# Altium schematic sheet STLink_V3E_PWR.SchDoc
size 420 x 297 mm; SheetNumber: 3; SheetTotal: 3
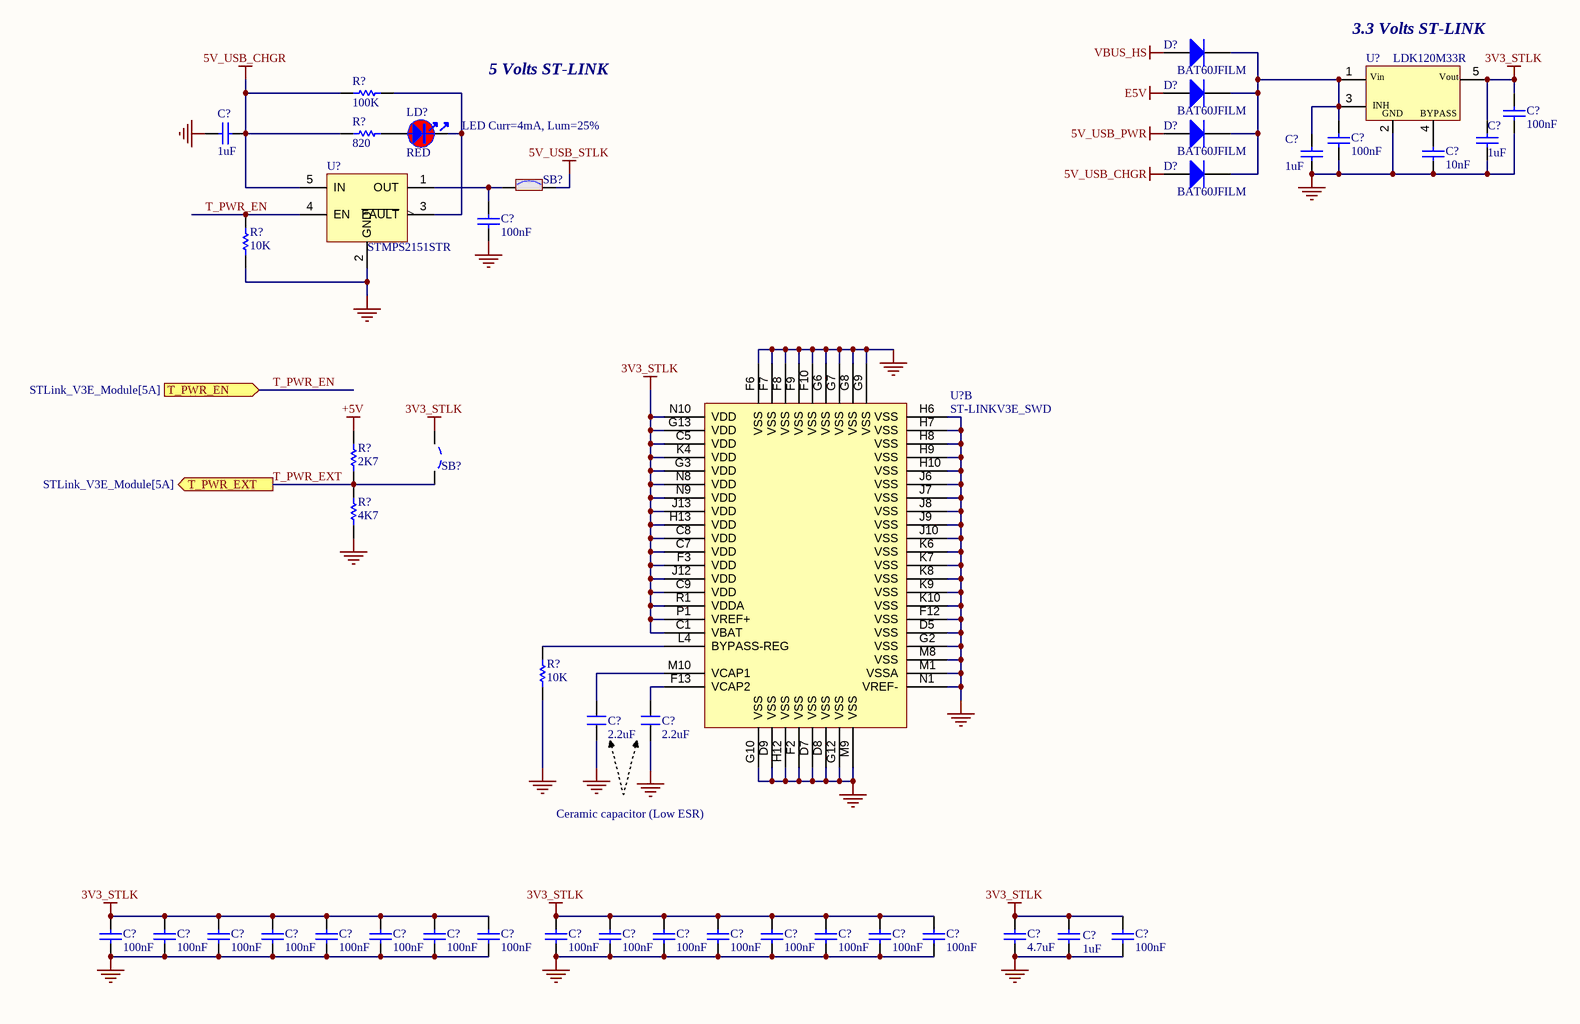
[diagram p0: STLink_V3E_PWR.SchDoc]

## Parts
(Parts that share a designator on the sheet are numbered #1, #2 ... from top to bottom, then left to right.)
C?#1  100nF  [0603C]
C?#2  1uF  [0603C]
C?#3  100nF  [0603C]
C?#4  1uF  [0603C]
C?#5  1uF  [0603C]
C?#6  10nF  [0603C]
C?#7  100nF  [0603C]
C?#8  2.2uF  [CN1.5]
C?#9  2.2uF  [CN1.5]
C?#10  100nF  [0402C]
C?#11  100nF  [0402C]
C?#12  100nF  [0402C]
C?#13  100nF  [0402C]
C?#14  100nF  [0402C]
C?#15  100nF  [0402C]
C?#16  100nF  [0402C]
C?#17  100nF  [0402C]
C?#18  100nF  [0402C]
C?#19  100nF  [0402C]
C?#20  100nF  [0402C]
C?#21  100nF  [0402C]
C?#22  100nF  [0402C]
C?#23  100nF  [0402C]
C?#24  100nF  [0402C]
C?#25  100nF  [0402C]
C?#26  4.7uF  [0603C]
C?#27  1uF  [0603C]
C?#28  100nF  [0603C]
D?#1  BAT60JFILM  [SOD-323]
D?#2  BAT60JFILM  [SOD-323]
D?#3  BAT60JFILM  [SOD-323]
D?#4  BAT60JFILM  [SOD-323]
LD?  value RED  [0603D]  (hidden comment: LED_red)
R?#1  100K  [0402R]
R?#2  820  [0603R]
R?#3  10K  [0603R]
R?#4  2K7  [0402R]
R?#5  4K7  [0402R]
R?#6  10K  [0402R]
SB?#1  Solder Bridge ON  [SB_0603]  (value not drawn)
SB?#2  Solder Bridge OFF  [SB_0603]  (value not drawn)
U?#1  LDK120M33R  [SOT23-5]
U?#2  STMPS2151STR  [SOT23-5]
U?#3  ST-LINKV3E_SWD  [BGA176_0R65_10x10]  (part B of 2)

## Ports
T_PWR_EN (in, see STLink_V3E_Module[5A]), T_PWR_EXT (out, see STLink_V3E_Module[5A])

## Nets
3V3_STLK: C?#1.2 C?#5.2 C?#10.2 C?#11.2 C?#12.2 C?#13.2 C?#14.2 C?#15.2 C?#16.2 C?#17.2 C?#18.2 C?#19.2 C?#20.2 C?#21.2 C?#22.2 C?#23.2 C?#24.2 C?#25.2 C?#26.2 C?#27.2 C?#28.2 SB?#2.1 U?#1.5(Vout) U?#3.C1(VBAT) U?#3.C5(VDD) U?#3.C7(VDD) U?#3.C8(VDD) U?#3.C9(VDD) U?#3.F3(VDD) U?#3.G3(VDD) U?#3.G13(VDD) U?#3.H13(VDD) U?#3.J12(VDD) U?#3.J13(VDD) U?#3.K4(VDD) U?#3.N8(VDD) U?#3.N9(VDD) U?#3.N10(VDD) U?#3.P1(VREF+) U?#3.R1(VDDA)
5V_USB_CHGR: C?#2.1 D?#4.1(A) R?#1.2 R?#2.1 U?#2.5(IN)
5V_USB_PWR: D?#3.1(A)
5V_USB_STLK: SB?#1.2
+5V: R?#4.2
E5V: D?#2.1(A)
GND: C?#1.1 C?#2.2 C?#3.1 C?#4.2 C?#5.1 C?#6.1 C?#7.1 C?#8.1 C?#9.1 C?#10.1 C?#11.1 C?#12.1 C?#13.1 C?#14.1 C?#15.1 C?#16.1 C?#17.1 C?#18.1 C?#19.1 C?#20.1 C?#21.1 C?#22.1 C?#23.1 C?#24.1 C?#25.1 C?#26.1 C?#27.1 C?#28.1 R?#3.1 R?#5.1 R?#6.1 U?#1.2(GND) U?#2.2(GND) U?#3.D5(VSS) U?#3.D7(VSS) U?#3.D8(VSS) U?#3.D9(VSS) U?#3.F2(VSS) U?#3.F6(VSS) U?#3.F7(VSS) U?#3.F8(VSS) U?#3.F9(VSS) U?#3.F10(VSS) U?#3.F12(VSS) U?#3.G2(VSS) U?#3.G6(VSS) U?#3.G7(VSS) U?#3.G8(VSS) U?#3.G9(VSS) U?#3.G10(VSS) U?#3.G12(VSS) U?#3.H6(VSS) U?#3.H7(VSS) U?#3.H8(VSS) U?#3.H9(VSS) U?#3.H10(VSS) U?#3.H12(VSS) U?#3.J6(VSS) U?#3.J7(VSS) U?#3.J8(VSS) U?#3.J9(VSS) U?#3.J10(VSS) U?#3.K6(VSS) U?#3.K7(VSS) U?#3.K8(VSS) U?#3.K9(VSS) U?#3.K10(VSS) U?#3.M1(VSSA) U?#3.M8(VSS) U?#3.M9(VSS) U?#3.N1(VREF-)
VBUS_HS: D?#1.1(A)
T_PWR_EN: R?#3.2 U?#2.4(EN) ; port T_PWR_EN
T_PWR_EXT: R?#4.1 R?#5.2 SB?#2.2 ; port T_PWR_EXT
NetC?#3_2: C?#3.2 C?#4.1 D?#1.2(K) D?#2.2(K) D?#3.2(K) D?#4.2(K) U?#1.1(Vin) U?#1.3(CE)
NetC?#6_2: C?#6.2 U?#1.4(BYPASS)
NetC?#7_2: C?#7.2 SB?#1.1 U?#2.1(OUT)
NetC?#8_2: C?#8.2 U?#3.M10(VCAP1)
NetC?#9_2: C?#9.2 U?#3.F13(VCAP2)
NetLD?_1: LD?.1 R?#2.2
NetLD?_2: LD?.2 R?#1.1 U?#2.3(~{FAULT})
NetR?#6_2: R?#6.2 U?#3.L4(BYPASS-REG)

## Notes on the sheet
- 5 Volts ST-LINK
- (near U?#1) 3.3 Volts ST-LINK
- (near LD?) LED Curr=4mA, Lum=25%
- Ceramic capacitor (Low ESR)
- ĐẠI HỌC QUỐC GIA THÀNH PHỐ HỒ CHÍ MINH
- TRƯỜNG ĐẠI HỌC BÁCH KHOA
- Sub-system:
- Project:
- Design by:
- Sheet title:
- Sheet
- of
- Checked by:
- Approved by:
- Doc no:
- Revision
- Size:
- Date:
- (in symbol MCD-00086) INH

## Library data of the parts
C?#1 C?#3 C?#28 = MCD-00211: Capacitor,100nF,16V,X7R,10%,0603; Manufacturer_Part_Number: CC0603KRX7R7BB104; Manufacturer: YAGEO; Provided_By: Subcon; Initial_Board_Reference: mb1319; Internal_Part_Number: MCD-00211; Value: 100nF; Status: Released; Package: 0603; ComponentLink1Description: Yageo_Capacitor_X7R-series.pdf; ECCN_US: n/a; ECCN_EU: n/a; Part_Type: Capacitor
C?#2 C?#5 C?#27 = MCD-00010: Capacitor,1uF,16V,X5R,10%,0603; Manufacturer_Part_Number: CC0603KRX5R7BB105; Manufacturer: YAGEO; Provided_By: Subcon; Initial_Board_Reference: mb1274; Internal_Part_Number: MCD-00010; Value: 1uF; Status: Released; Package: 0603; ComponentLink1Description: Yageo_Capacitor_X5R-series.pdf; ECCN_US: n/a; ECCN_EU: n/a; Part_Type: Capacitor
C?#4 = MCD-00238: Capacitor,1uF,6V3,X5R,10%,0603; Manufacturer_Part_Number: CC0603KRX5R5BB105; Manufacturer: YAGEO; Provided_By: Subcon; Initial_Board_Reference: mb1319; Internal_Part_Number: MCD-00238; Value: 1uF; Status: Released; Part_Type: Capacitor; Package: 0603; ComponentLink1Description: Yageo_Capacitor_X5R-series.pdf; ECCN_US: n/a; ECCN_EU: n/a
C?#6 = MCD-00017: Capacitor,10nF,50V,X7R,10%,0603; Manufacturer_Part_Number: CC0603KRX7R9BB103; Manufacturer: YAGEO; Provided_By: Subcon; Initial_Board_Reference: mb1274; Internal_Part_Number: MCD-00017; Value: 10nF; Status: Released; Package: 0603; ComponentLink1Description: Yageo_Capacitor_X7R-series.pdf; ECCN_US: n/a; ECCN_EU: n/a; Part_Type: Capacitor
C?#7 = MCD-00006: Capacitor, MLCC, 100nF, 16V, X7R, 10%, 0402, T=0.5mm; Manufacturer_Part_Number: CC0402KRX7R7BB104; Manufacturer: YAGEO; Provided_By: Subcon; Initial_Board_Reference: MB1274; Internal_Part_Number: MCD-00006; Value: 100nF; Status: Released; Package: C0402; ComponentLink1Description: Yageo_Capacitor_X7R-series.pdf; ECCN_US: n/a; ECCN_EU: n/a; Part_Type: Capacitor; ComponentLink1URL: http://tunmcdsvn.tun.st.com/Component_Datasheet_Library/Trunk/Capacitors/Yageo_Multilayer_Capacitor_X7R_series_100pF_to_22uF
C?#8 C?#9 = Cap: Value: 33pF
C?#10-C?#25 = MCD-00102: Capacitor,100nF,16V,X7R,10%,0402; Manufacturer_Part_Number: CC0402KRX7R7BB104; Manufacturer: YAGEO; Provided_By: Subcon; Initial_Board_Reference: mb1262; Internal_Part_Number: MCD-00102; Value: 100nF; Status: Released; Package: 0402; ComponentLink1Description: Capacitor_X7R_100pF_to_22uF.pdf; ECCN_US: n/a; ECCN_EU: n/a; Part_Type: Capacitor
C?#26 = MCD-00009: Capacitor,4.7uF,16V, X5R,10%,0603; Manufacturer_Part_Number: CC0603KRX5R7BB475; Manufacturer: YAGEO; Provided_By: subcon; Initial_Board_Reference: mb1274; Internal_Part_Number: MCD-00009; Value: 4.7uF; Status: Released; Part_Type: Capacitor; Package: 0603; ComponentLink1Description: Yageo_Capacitor_X5R-series.pdf; ECCN_US: n/a; ECCN_EU: n/a
D?#1-D?#4 = MCD-00034: Manuf_1: STM; ECCN_US/EU: EAR99/NEC; Fitted: YES; Initial_Board_Reference: mb1274; Internal_Part_Number: MCD-00034; Value: BAT60JFILM; Status: Released; Manuf_Part_1: BAT60JFILM; ComponentLink1Description: STM_Diode_BAT60JFILM-SOD323.pdf; Ordered by: STM
LD? = MCD-00587: LED Red, 0603 SMD, 2V Forward Voltage; Part_Type: Display; Manufacturer_Part_Number: VLMS1300-GS08; Manufacturer: VISHAY; Alternate_Manufacturer_Part_Number: LS Q976-NR-1; Alternate_Manufacturer: OSRAM OPTO SEMICONDUCTORS; Provided_By: Subcon; Initial_Board_Reference: MB1331; Internal_Part_Number: MCD-00587; Status: Footprint available; ComponentLink1Description: VISHAY_LED_RED_VLMS1300-GS08.pdf; ComponentLink1URL: http://tunmcdsvn.tun.st.com/Component_Datasheet_Library/Trunk/display/VISHAY_LED_RED_VLMS1300-GS08; Order_Code_Digikey: VLMS1300-GS08CT-ND; Order_Code_Farnell: 2078728; Package: LED 0603; ECCN_US: n/a; ECCN_EU: n/a
R?#1 = MCD-00059: Resistor,100K,0402,1%,1/16W; Manufacturer_Part_Number: RC0402FR-07100KL; Manufacturer: YAGEO; Alternate_Manufacturer_Part_Number: RT0402FRE07100KL; Provided_By: Subcon; Initial_Board_Reference: mb1274; Internal_Part_Number: MCD-00059; Value: 100K; Status: Released; ComponentLink1Description: Yageo_Resistor_RC0402-series.pdf; ECCN_US: n/a; ECCN_EU: n/a; Alternate_Manufacturer: YAGEO; Part_Type: Resistor
R?#2 = MCD-00527: Resistor,820R,0402,1%,1/16W; Manufacturer_Part_Number: RC0402FR-07820RL; Manufacturer: YAGEO; Provided_By: Subcon; Internal_Part_Number: MCD-00527; Value: 820; Status: Released; Part_Type: Resistor; Package: R0402; ComponentLink1Description: Yageo_Resistor_RC0402-series.pdf; ComponentLink1URL: http://tunmcdsvn.tun.st.com/Component_Datasheet_Library/Trunk/Resistors/Yageo_Resistor_RC0402-series; ECCN_US: n/a; ECCN_EU: n/a
R?#3 = MCD-00053: Resistor,10K,0402,1%,1/16W; Manufacturer_Part_Number: RC0402FR-0710KL; Manufacturer: YAGEO; Provided_By: subcon; Initial_Board_Reference: MB1274; Internal_Part_Number: MCD-00053; Value: 10K; Status: Released; ComponentLink1Description: Yageo_Resistor_RC0402-series.pdf; ECCN_US: n/a; ECCN_EU: n/a; Part_Type: Resistor; Package: R0402; ComponentLink1URL: http://tunmcdsvn.tun.st.com/Component_Datasheet_Library/Trunk/Resistors/Yageo_Resistor_RC0402-series
R?#4 = MCD-00055: Resistor,2K7,0402,1%,1/16W; Manufacturer_Part_Number: RC0402FR-072K7L; Manufacturer: YAGEO; Provided_By: Subcon; Initial_Board_Reference: mb1274; Internal_Part_Number: MCD-00055; Value: 2K7; Status: Released; ComponentLink1Description: Yageo_Resistor_RC0402-series.pdf; ECCN_US: n/a; ECCN_EU: n/a; Part_Type: Resistor
R?#5 = MCD-00065: Resistor,4K7,0402,1%,1/16W; Manufacturer_Part_Number: RC0402FR-074K7L; Manufacturer: YAGEO; Alternate_Manufacturer_Part_Number: RT0402FRE074K7L; Provided_By: Subcon; Initial_Board_Reference: mb1274; Internal_Part_Number: MCD-00065; Value: 4K7; Status: Released; ComponentLink1Description: Yageo_Resistor_RC0402-series.pdf; ECCN_US: n/a; ECCN_EU: n/a; Alternate_Manufacturer: YAGEO; Part_Type: Resistor
R?#6 = MCD-00053: Resistor,10K,0402,1%,1/16W; Manufacturer_Part_Number: RC0402FR-0710KL; Manufacturer: YAGEO; Provided_By: subcon; Initial_Board_Reference: mb1274; Internal_Part_Number: MCD-00053; Value: 10K; Status: Released; ComponentLink1Description: Yageo_Resistor_RC0402-series.pdf; ECCN_US: n/a; ECCN_EU: n/a; Part_Type: Resistor
SB?#1 = SB_ON: Fitted: YES; Ordered by: Subcon; Revision: July-2002: Re-released for DXP Platform.; ECCN_US/EU: n/a
SB?#2 = SB_OFF: Fitted: NO; Ordered by: Subcon; Revision: July-2002: Re-released for DXP Platform.; ECCN_US/EU: n/a
U?#1 = MCD-00086: Ultra low drop-low noise BiCMOS voltage, regulators low ESR capacitors compatible; Manuf_1: STM; ECCN_US/EU: EAR99/NEC; Fitted: YES; Initial_Board_Reference: mb1248; Internal_Part_Number: MCD-00086; Value: LDK120M33R; Status: Released; Manuf_Part_1: LDK120M33R; ComponentLink1Description: STM_LDO_LD3985.pdf; Ordered by: STM
U?#2 = MCD-00159: 500mA, Enhanced single channel power switches with active high enable pin; Part_Type: IC; Manufacturer: STMICROELECTRONICS; ECCN_US: EAR99; ECCN_EU: NEC; Provided_By: Subcon; Initial_Board_Reference: MB1264; Internal_Part_Number: MCD-00159; Value: STMPS2151STR; Status: Footprint available; Manufacturer_Part_Number: STMPS2151STR; ComponentLink1Description: STM_PWR-Switch_STMPS2151STR.pdf; ComponentLink1URL: http://tunmcdsvn.tun.st.com/Component_Datasheet_Library/Trunk/IC/STM_PWR-Switch_STMPS2151STR
U?#3 = ST-LINKV3E_SWD: STM32F723IEK  (STM32F7 LittleBirdie) BGA176; Internal_Part_Number: MCD-00596; Manuf_Part_1: STM32F723IEK6; Manuf_1: STM; Initial_Board_Reference: mb1331; Fitted: YES; ECCN_US/EU: 3A991A2/NEC; Value: ST-LINKV3E_SWD; ComponentLink1Description: BGA176+25L_10x10x0.6_pitch0.65.pdf; ComponentLink1URL: http://tunmcdsvn.tun.st.com/Component_Datasheet_Library/Trunk/IC/BGA176+25L_10x10x0.6_pitch0.65.pdf; Ordered by: STM